# EAGLE design program (EAGLE 8.4.3)
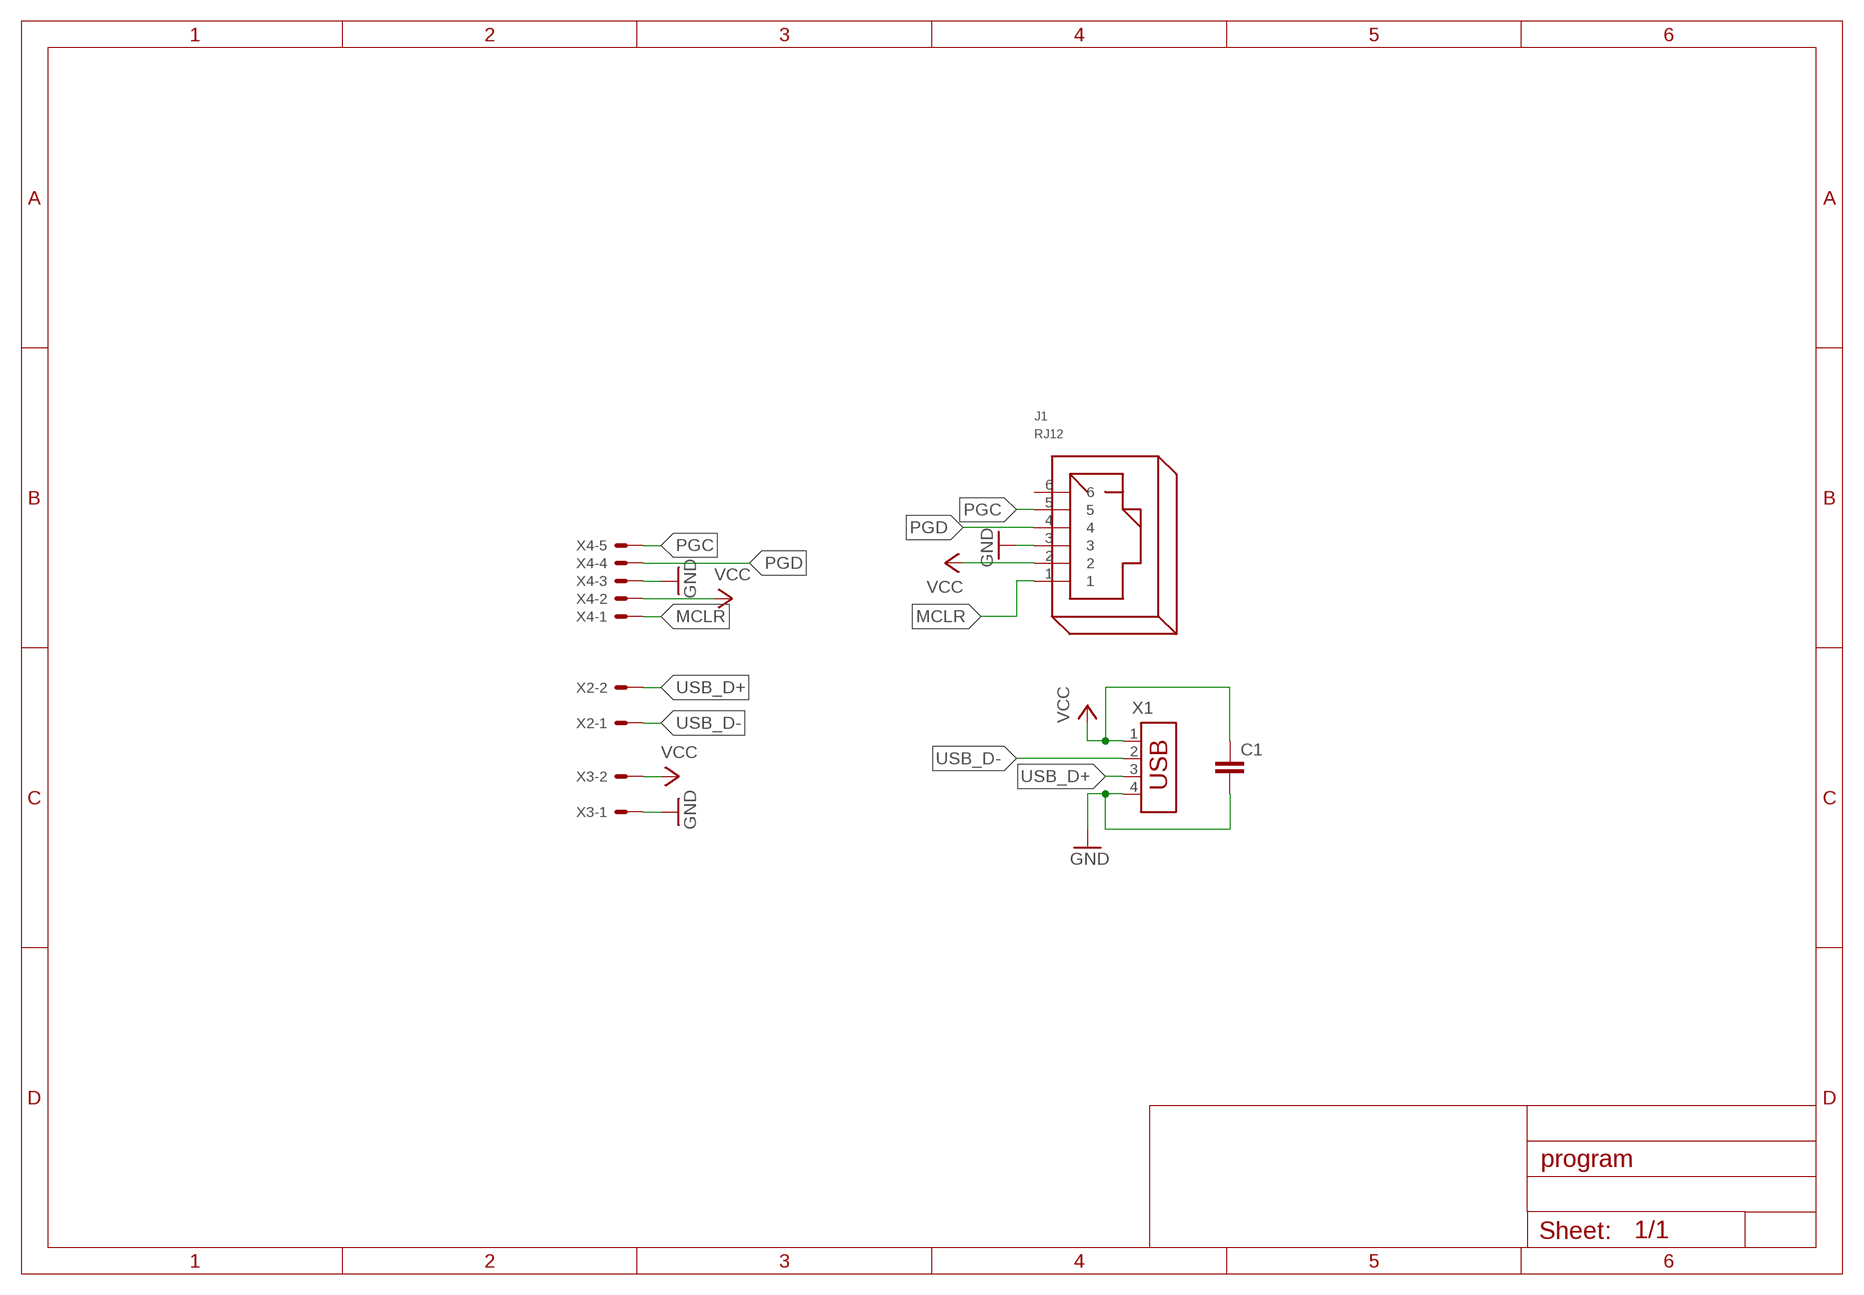
[diagram p0: schematic, sheet 1]

## Parts
C1  C-EU025-030X050  [C025-030X050]
J1  RJ12  [RJ12]
X1  USB-787616  [USB]
X2  KK-156-2  [KK-156-2]
X3  KK-156-2  [KK-156-2]
X4  KK-156-5  [KK-156-5]

## Nets
GND: C1.2 J1.3 X1.4 X3.1 X4.3
MCLR: J1.1 X4.1
PGC: J1.5 X4.5
PGD: J1.4 X4.4
USB_D+: X1.3 X2.2
USB_D-: X1.2 X2.1
VCC: C1.1 J1.2 X1.1 X3.2 X4.2
Unconnected: J1.6

## Library data of the parts
C1 = rcl:C-EU: CAPACITOR, European symbol
J1 = con-rj:RJ12: RJ12, RJ14 and RJ25 RJ12, RJ14 and RJ25 jacks side mounted http://www.tycoelectronics.com
X1 = con-amp:USB-787616: AMP connector
X2 X3 = con-molex:KK-156-2: KK 156 HEADER Source: http://www.molex.com/pdm_docs/sd/026604100_sd.pdf; OC_FARNELL: unknown; OC_NEWARK: unknown
X4 = con-molex:KK-156-5: KK 156 HEADER Source: http://www.molex.com/pdm_docs/sd/026604100_sd.pdf; OC_FARNELL: unknown; OC_NEWARK: unknown

## Board
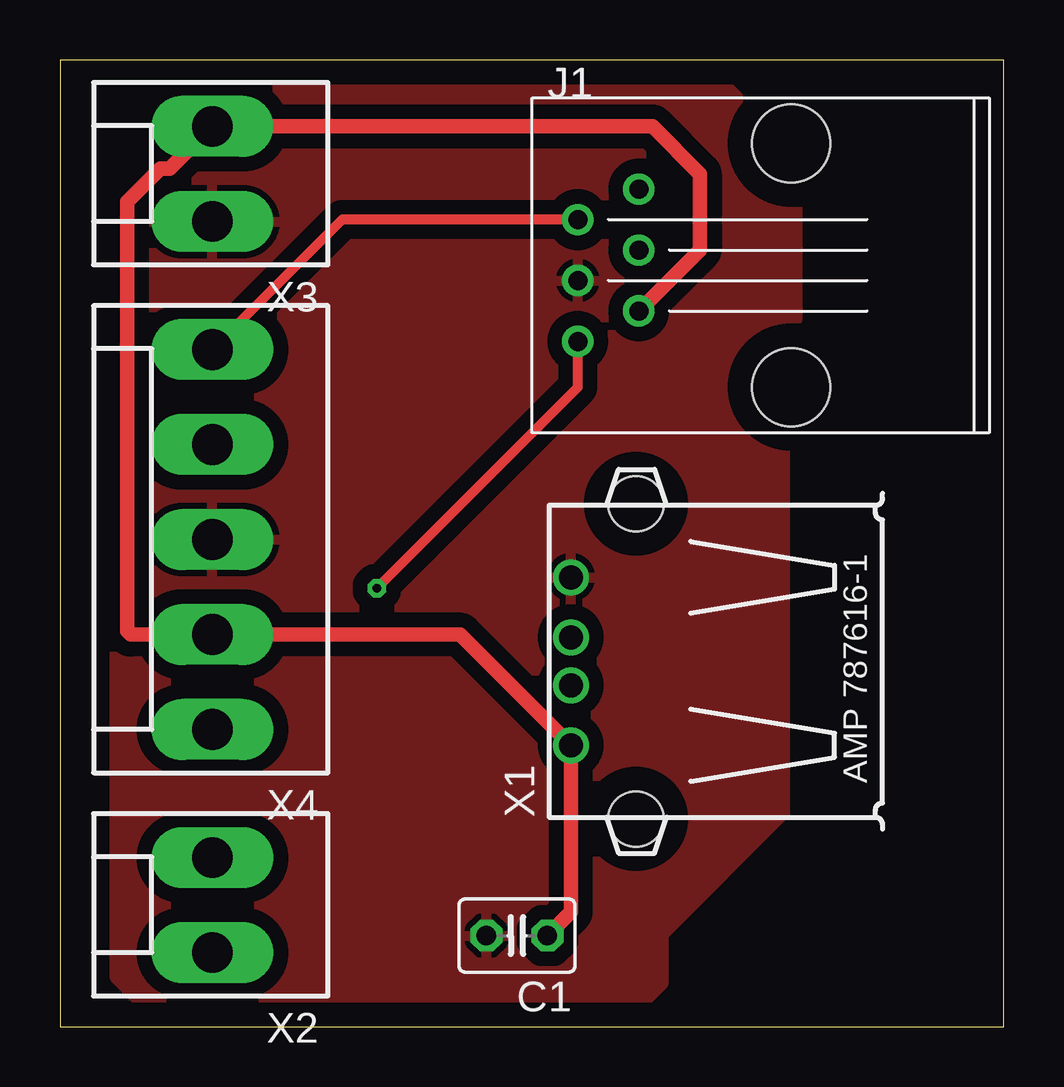
[diagram p1: board, top side]
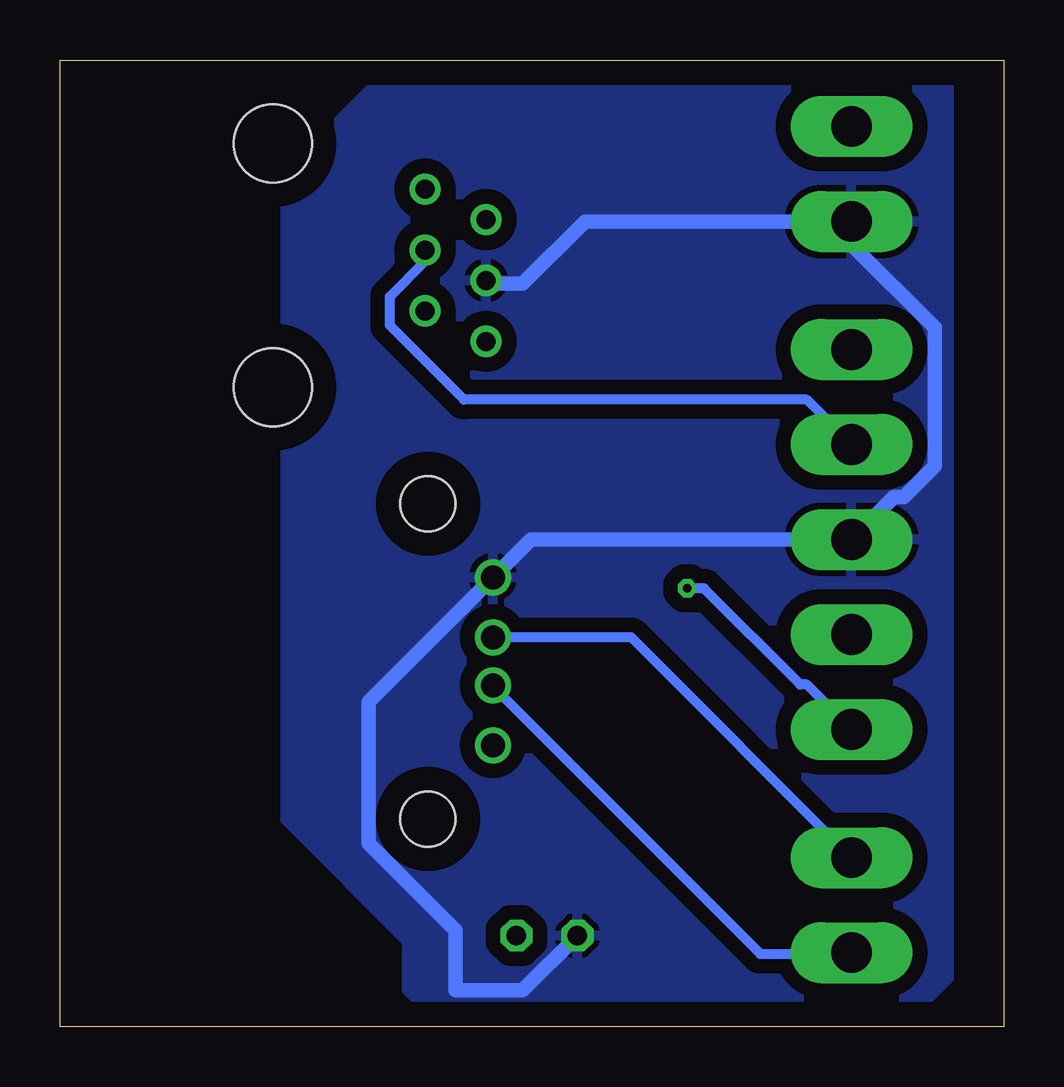
[diagram p2: board, bottom side, seen from below]

Size 39.35 x 40.31 mm. Coordinates in mm from the lower left corner, seen from the top.
Outline: 0,0 39.35,0 39.35,40.31 0,40.31 0,0
Copper layers (1*16): Top 0.035mm / dielectric 1.5mm / Bottom 0.035mm
Design rules "default *": minimum track width 6mil, minimum drill 0.35mm, track to track 24mil, track to pad 24mil, pad to pad 24mil, via to via 24mil, smd to smd 6mil, copper to edge 40mil, drill to drill 6mil, minimum pad ring 10mil, minimum via ring 8mil, stop-mask expansion 4mil, vias tented up to drill 0mil, thermal gap 10mil

### Footprints (pad centres in the part's own frame; a part is rotated, then mirrored left to right if it is on the bottom)
C025-030X050 = drill 0.813 octagon: 1 -1.27,0; 2 1.27,0
RJ12 = drill 0.8: 1 -8.89,-3.175; 2 -6.35,-1.905; 3 -8.89,-0.635; 4 -6.35,0.635; 5 -8.89,1.905; 6 -6.35,3.175 | hole 3.25: 0,-5.08; 0,5.08
USB = drill 1: 1 -3.5,12.99; 2 -1,12.99; 3 1,12.99; 4 3.5,12.99 | hole 2.3: -6.57,10.28; 6.57,10.28
KK-156-2 = drill 1.7 pad 2.184 long: 1 -1.98,0; 2 1.98,0
KK-156-5 = drill 1.7 pad 2.184 long: 1 -7.92,0; 2 -3.96,0; 3 0,0; 4 3.96,0; 5 7.92,0

### Placement (x,y rotation side)
C1  19.05,3.81 180 top
J1  30.48,31.75 0 top
X1  34.29,15.24 90 top
X2  6.35,5.08 90 top
X3  6.35,35.56 90 top
X4  6.35,20.32 90 top

### Tracks (layer width: path | path; a pad name or v marks a point on that pad's centre or on a via)
GND
  Bottom 0.61: J1.3 21.46,30.99 20.07,30.99 17.47,33.58 X3.1 6.35,32.61 2.89,29.15 2.89,23.37 4.17,22.09 4.58,22.09 X4.3 19.72,20.32 X1.4 26.48,13.56 26.48,7.65 22.86,4.03 22.86,1.52 20.07,1.52 C1.2
  pour Bottom: 2.54,39.62 25.91,39.62 29.97,35.56 29.97,8.64 24.89,3.56 24.89,1.52 23.88,0.51 3.81,0.51 2.29,2.03 2.29,39.37
  pour Top: 2.54,39.62 27.43,39.62 30.73,36.32 30.73,29.46 30.23,28.96 30.23,8.89 25.15,3.81 25.15,1.78 23.88,0.51 3.81,0.51 2.29,2.03 2.29,39.37
MCLR  (via drill 0.35)
  Top 0.406: v13.21,18.29 21.59,26.67 J1.1
  Bottom 0.406: X4.1 8.22,14.27 8.49,14.27 12.51,18.29 v13.21,18.29
PGC
  Top 0.406: J1.5 11.77,33.66 X4.5
PGD
  Bottom 0.406: X4.4 8.22,26.15 22.51,26.15 25.6,29.24 25.6,30.45 24.13,31.92 J1.4
USB_D+
  Bottom 0.406: X2.2 15.53,16.24 X1.3
USB_D-
  Bottom 0.406: X1.2 21.3,14.19 10.16,3.05 6.4,3.05 X2.1
VCC
  Top 0.61: J1.2 26.67,32.38 26.67,35.56 24.69,37.54 X3.2 4.58,35.77 4.17,35.77 2.79,34.4 2.79,16.51 2.94,16.36 16.68,16.36 | 16.68,16.36 X1.1 21.3,4.79 C1.1 | 16.68,16.36 X4.2